# EAGLE design Backplane2 (EAGLE 7.7.0)
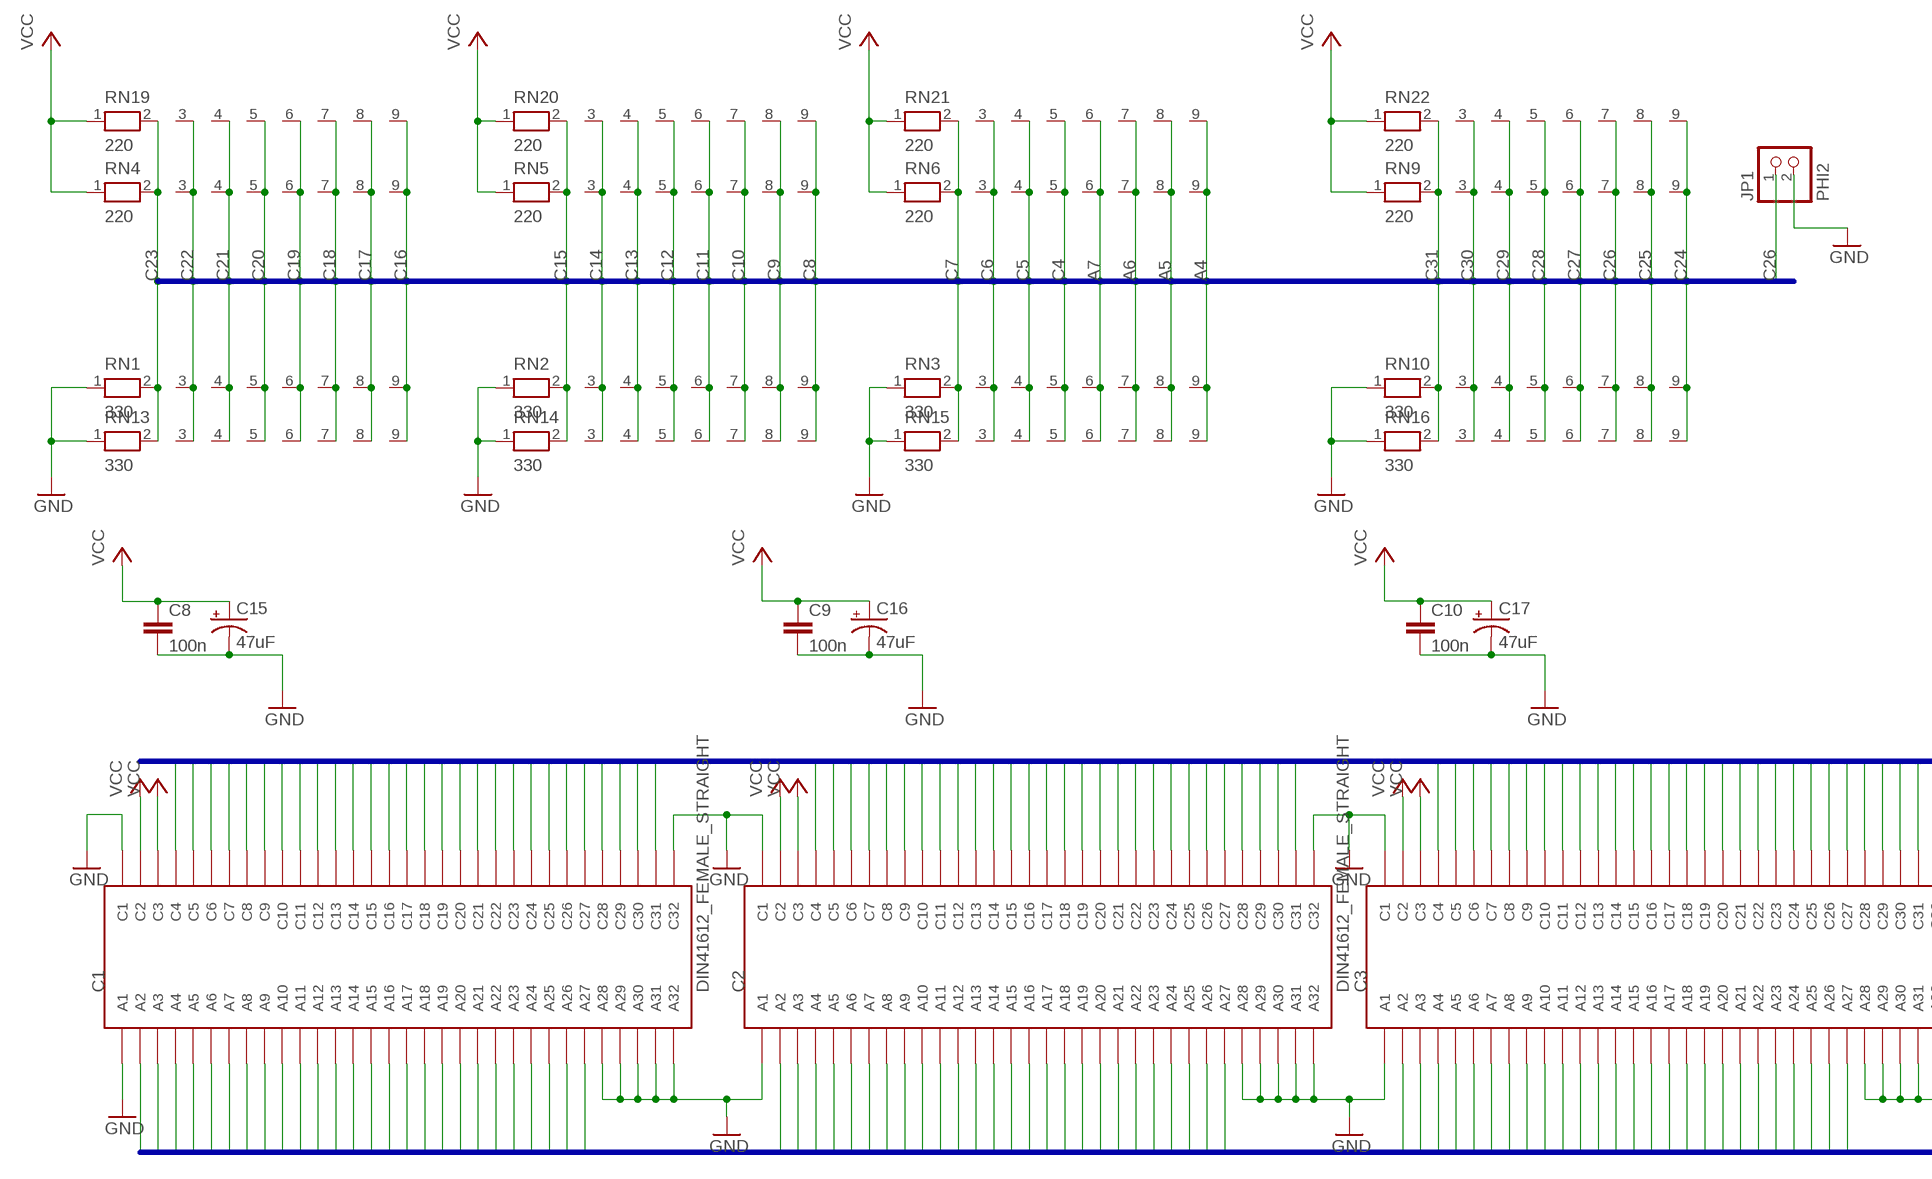
[diagram p0: schematic, sheet 1, part 1 of 2]
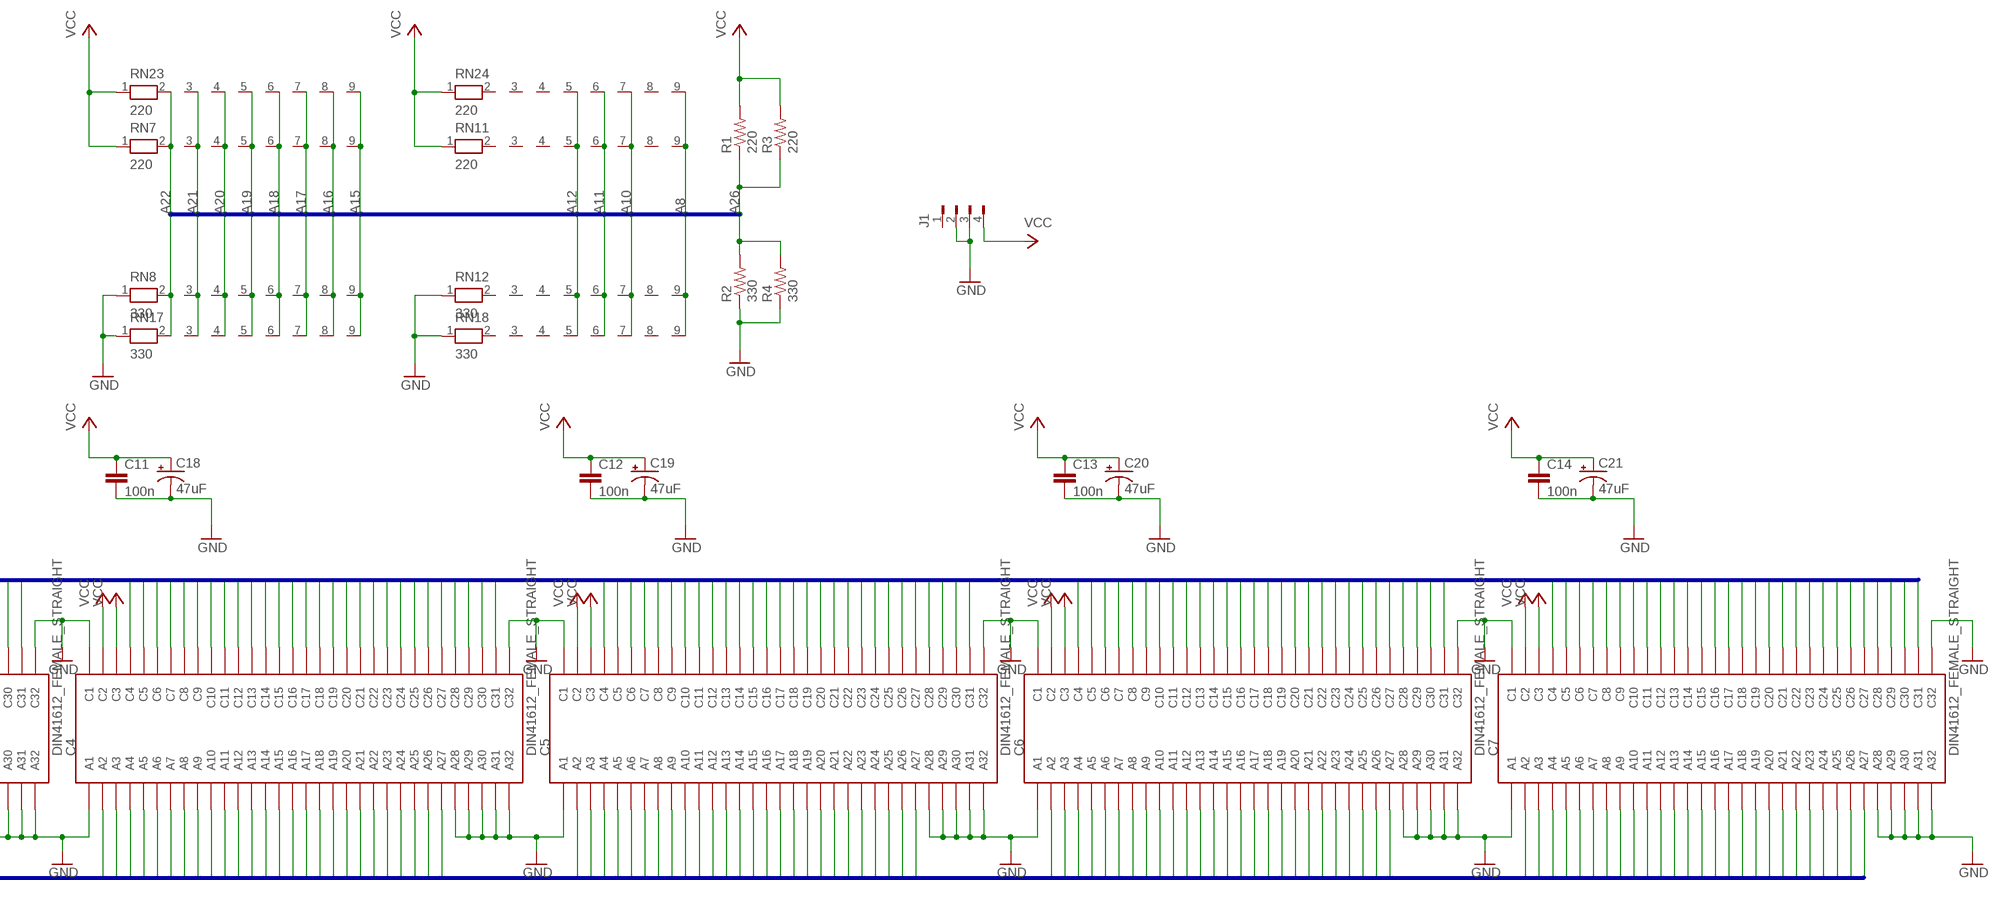
[diagram p1: schematic, sheet 1, part 2 of 2]

## Parts
C1  DIN41612_FEMALE_STRAIGHT  [DIN41612_FEMALE_STRAIGHT]
C2  DIN41612_FEMALE_STRAIGHT  [DIN41612_FEMALE_STRAIGHT]
C3  DIN41612_FEMALE_STRAIGHT  [DIN41612_FEMALE_STRAIGHT]
C4  DIN41612_FEMALE_STRAIGHT  [DIN41612_FEMALE_STRAIGHT]
C5  DIN41612_FEMALE_STRAIGHT  [DIN41612_FEMALE_STRAIGHT]
C6  DIN41612_FEMALE_STRAIGHT  [DIN41612_FEMALE_STRAIGHT]
C7  DIN41612_FEMALE_STRAIGHT  [DIN41612_FEMALE_STRAIGHT]
C8  100n  C-EU025-025X050  [C025-025X050]
C9  100n  C-EU025-025X050  [C025-025X050]
C10  100n  C-EU025-025X050  [C025-025X050]
C11  100n  C-EU025-025X050  [C025-025X050]
C12  100n  C-EU025-025X050  [C025-025X050]
C13  100n  C-EU025-025X050  [C025-025X050]
C14  100n  C-EU025-025X050  [C025-025X050]
C15  47uF  CPOL-USE2.5-7  [E2,5-7]
C16  47uF  CPOL-USE2.5-7  [E2,5-7]
C17  47uF  CPOL-USE2.5-7  [E2,5-7]
C18  47uF  CPOL-USE2.5-7  [E2,5-7]
C19  47uF  CPOL-USE2.5-7  [E2,5-7]
C20  47uF  CPOL-USE2.5-7  [E2,5-7]
C21  47uF  CPOL-USE2.5-7  [E2,5-7]
J1  FLOPPY-4350211  [350211]
JP1  PHI2  PINHD-1X2  [1X02]
R1  220  R-US_0204/5  [0204/5]
R2  330  R-US_0204/5  [0204/5]
R3  220  R-US_0204/5  [0204/5]
R4  330  R-US_0204/5  [0204/5]
RN1  330  RN08  [RN-9]
RN2  330  RN08  [RN-9]
RN3  330  RN08  [RN-9]
RN4  220  RN08  [RN-9]
RN5  220  RN08  [RN-9]
RN6  220  RN08  [RN-9]
RN7  220  RN08  [RN-9]
RN8  330  RN08  [RN-9]
RN9  220  RN08  [RN-9]
RN10  330  RN08  [RN-9]
RN11  220  RN08  [RN-9]
RN12  330  RN08  [RN-9]
RN13  330  RN08  [RN-9]
RN14  330  RN08  [RN-9]
RN15  330  RN08  [RN-9]
RN16  330  RN08  [RN-9]
RN17  330  RN08  [RN-9]
RN18  330  RN08  [RN-9]
RN19  220  RN08  [RN-9]
RN20  220  RN08  [RN-9]
RN21  220  RN08  [RN-9]
RN22  220  RN08  [RN-9]
RN23  220  RN08  [RN-9]
RN24  220  RN08  [RN-9]

## Nets
A2: C1.A2 C2.A2 C3.A2 C4.A2 C5.A2 C6.A2 C7.A2
A3: C1.A3 C2.A3 C3.A3 C4.A3 C5.A3 C6.A3 C7.A3
A4: C1.A4 C2.A4 C3.A4 C4.A4 C5.A4 C6.A4 C7.A4 RN3.9 RN6.9 RN15.9 RN21.9
A5: C1.A5 C2.A5 C3.A5 C4.A5 C5.A5 C6.A5 C7.A5 RN3.8 RN6.8 RN15.8 RN21.8
A6: C1.A6 C2.A6 C3.A6 C4.A6 C5.A6 C6.A6 C7.A6 RN3.7 RN6.7 RN15.7 RN21.7
A7: C1.A7 C2.A7 C3.A7 C4.A7 C5.A7 C6.A7 C7.A7 RN3.6 RN6.6 RN15.6 RN21.6
A8: C1.A8 C2.A8 C3.A8 C4.A8 C5.A8 C6.A8 C7.A8 RN11.9 RN12.9 RN18.9 RN24.9
A9: C1.A9 C2.A9 C3.A9 C4.A9 C5.A9 C6.A9 C7.A9
A10: C1.A10 C2.A10 C3.A10 C4.A10 C5.A10 C6.A10 C7.A10 RN11.7 RN12.7 RN18.7 RN24.7
A11: C1.A11 C2.A11 C3.A11 C4.A11 C5.A11 C6.A11 C7.A11 RN11.6 RN12.6 RN18.6 RN24.6
A12: C1.A12 C2.A12 C3.A12 C4.A12 C5.A12 C6.A12 C7.A12 RN11.5 RN12.5 RN18.5 RN24.5
A13: C1.A13 C2.A13 C3.A13 C4.A13 C5.A13 C6.A13 C7.A13
A14: C1.A14 C2.A14 C3.A14 C4.A14 C5.A14 C6.A14 C7.A14
A15: C1.A15 C2.A15 C3.A15 C4.A15 C5.A15 C6.A15 C7.A15 RN7.9 RN8.9 RN17.9 RN23.9
A16: C1.A16 C2.A16 C3.A16 C4.A16 C5.A16 C6.A16 C7.A16 RN7.8 RN8.8 RN17.8 RN23.8
A17: C1.A17 C2.A17 C3.A17 C4.A17 C5.A17 C6.A17 C7.A17 RN7.7 RN8.7 RN17.7 RN23.7
A18: C1.A18 C2.A18 C3.A18 C4.A18 C5.A18 C6.A18 C7.A18 RN7.6 RN8.6 RN17.6 RN23.6
A19: C1.A19 C2.A19 C3.A19 C4.A19 C5.A19 C6.A19 C7.A19 RN7.5 RN8.5 RN17.5 RN23.5
A20: C1.A20 C2.A20 C3.A20 C4.A20 C5.A20 C6.A20 C7.A20 RN7.4 RN8.4 RN17.4 RN23.4
A21: C1.A21 C2.A21 C3.A21 C4.A21 C5.A21 C6.A21 C7.A21 RN7.3 RN8.3 RN17.3 RN23.3
A22: C1.A22 C2.A22 C3.A22 C4.A22 C5.A22 C6.A22 C7.A22 RN7.2 RN8.2 RN17.2 RN23.2
A23: C1.A23 C2.A23 C3.A23 C4.A23 C5.A23 C6.A23 C7.A23
A24: C1.A24 C2.A24 C3.A24 C4.A24 C5.A24 C6.A24 C7.A24
A25: C1.A25 C2.A25 C3.A25 C4.A25 C5.A25 C6.A25 C7.A25
A26: C1.A26 C2.A26 C3.A26 C4.A26 C5.A26 C6.A26 C7.A26 R1.1 R2.2 R3.1 R4.2
A27: C1.A27 C2.A27 C3.A27 C4.A27 C5.A27 C6.A27 C7.A27
C4: C1.C4 C2.C4 C3.C4 C4.C4 C5.C4 C6.C4 C7.C4 RN3.5 RN6.5 RN15.5 RN21.5
C5: C1.C5 C2.C5 C3.C5 C4.C5 C5.C5 C6.C5 C7.C5 RN3.4 RN6.4 RN15.4 RN21.4
C6: C1.C6 C2.C6 C3.C6 C4.C6 C5.C6 C6.C6 C7.C6 RN3.3 RN6.3 RN15.3 RN21.3
C7: C1.C7 C2.C7 C3.C7 C4.C7 C5.C7 C6.C7 C7.C7 RN3.2 RN6.2 RN15.2 RN21.2
C8: C1.C8 C2.C8 C3.C8 C4.C8 C5.C8 C6.C8 C7.C8 RN2.9 RN5.9 RN14.9 RN20.9
C9: C1.C9 C2.C9 C3.C9 C4.C9 C5.C9 C6.C9 C7.C9 RN2.8 RN5.8 RN14.8 RN20.8
C10: C1.C10 C2.C10 C3.C10 C4.C10 C5.C10 C6.C10 C7.C10 RN2.7 RN5.7 RN14.7 RN20.7
C11: C1.C11 C2.C11 C3.C11 C4.C11 C5.C11 C6.C11 C7.C11 RN2.6 RN5.6 RN14.6 RN20.6
C12: C1.C12 C2.C12 C3.C12 C4.C12 C5.C12 C6.C12 C7.C12 RN2.5 RN5.5 RN14.5 RN20.5
C13: C1.C13 C2.C13 C3.C13 C4.C13 C5.C13 C6.C13 C7.C13 RN2.4 RN5.4 RN14.4 RN20.4
C14: C1.C14 C2.C14 C3.C14 C4.C14 C5.C14 C6.C14 C7.C14 RN2.3 RN5.3 RN14.3 RN20.3
C15: C1.C15 C2.C15 C3.C15 C4.C15 C5.C15 C6.C15 C7.C15 RN2.2 RN5.2 RN14.2 RN20.2
C16: C1.C16 C2.C16 C3.C16 C4.C16 C5.C16 C6.C16 C7.C16 RN1.9 RN4.9 RN13.9 RN19.9
C17: C1.C17 C2.C17 C3.C17 C4.C17 C5.C17 C6.C17 C7.C17 RN1.8 RN4.8 RN13.8 RN19.8
C18: C1.C18 C2.C18 C3.C18 C4.C18 C5.C18 C6.C18 C7.C18 RN1.7 RN4.7 RN13.7 RN19.7
C19: C1.C19 C2.C19 C3.C19 C4.C19 C5.C19 C6.C19 C7.C19 RN1.6 RN4.6 RN13.6 RN19.6
C20: C1.C20 C2.C20 C3.C20 C4.C20 C5.C20 C6.C20 C7.C20 RN1.5 RN4.5 RN13.5 RN19.5
C21: C1.C21 C2.C21 C3.C21 C4.C21 C5.C21 C6.C21 C7.C21 RN1.4 RN4.4 RN13.4 RN19.4
C22: C1.C22 C2.C22 C3.C22 C4.C22 C5.C22 C6.C22 C7.C22 RN1.3 RN4.3 RN13.3 RN19.3
C23: C1.C23 C2.C23 C3.C23 C4.C23 C5.C23 C6.C23 C7.C23 RN1.2 RN4.2 RN13.2 RN19.2
C24: C1.C24 C2.C24 C3.C24 C4.C24 C5.C24 C6.C24 C7.C24 RN9.9 RN10.9 RN16.9 RN22.9
C25: C1.C25 C2.C25 C3.C25 C4.C25 C5.C25 C6.C25 C7.C25 RN9.8 RN10.8 RN16.8 RN22.8
C26: C1.C26 C2.C26 C3.C26 C4.C26 C5.C26 C6.C26 C7.C26 JP1.1 RN9.7 RN10.7 RN16.7 RN22.7
C27: C1.C27 C2.C27 C3.C27 C4.C27 C5.C27 C6.C27 C7.C27 RN9.6 RN10.6 RN16.6 RN22.6
C28: C1.C28 C2.C28 C3.C28 C4.C28 C5.C28 C6.C28 C7.C28 RN9.5 RN10.5 RN16.5 RN22.5
C29: C1.C29 C2.C29 C3.C29 C4.C29 C5.C29 C6.C29 C7.C29 RN9.4 RN10.4 RN16.4 RN22.4
C30: C1.C30 C2.C30 C3.C30 C4.C30 C5.C30 C6.C30 C7.C30 RN9.3 RN10.3 RN16.3 RN22.3
C31: C1.C31 C2.C31 C3.C31 C4.C31 C5.C31 C6.C31 C7.C31 RN9.2 RN10.2 RN16.2 RN22.2
GND: C1.A1 C1.A28 C1.A29 C1.A30 C1.A31 C1.A32 C1.C1 C1.C32 C2.A1 C2.A28 C2.A29 C2.A30 C2.A31 C2.A32 C2.C1 C2.C32 C3.A1 C3.A28 C3.A29 C3.A30 C3.A31 C3.A32 C3.C1 C3.C32 C4.A1 C4.A28 C4.A29 C4.A30 C4.A31 C4.A32 C4.C1 C4.C32 C5.A1 C5.A28 C5.A29 C5.A30 C5.A31 C5.A32 C5.C1 C5.C32 C6.A1 C6.A28 C6.A29 C6.A30 C6.A31 C6.A32 C6.C1 C6.C32 C7.A1 C7.A28 C7.A29 C7.A30 C7.A31 C7.A32 C7.C1 C7.C32 C8.2 C9.2 C10.2 C11.2 C12.2 C13.2 C14.2 C15.- C16.- C17.- C18.- C19.- C20.- C21.- J1.2 J1.3 JP1.2 R2.1 R4.1 RN1.1 RN2.1 RN3.1 RN8.1 RN10.1 RN12.1 RN13.1 RN14.1 RN15.1 RN16.1 RN17.1 RN18.1
VCC: C1.C2 C1.C3 C2.C2 C2.C3 C3.C2 C3.C3 C4.C2 C4.C3 C5.C2 C5.C3 C6.C2 C6.C3 C7.C2 C7.C3 C8.1 C9.1 C10.1 C11.1 C12.1 C13.1 C14.1 C15.+ C16.+ C17.+ C18.+ C19.+ C20.+ C21.+ J1.4 R1.2 R3.2 RN4.1 RN5.1 RN6.1 RN7.1 RN9.1 RN11.1 RN19.1 RN20.1 RN21.1 RN22.1 RN23.1 RN24.1
Unconnected: J1.1 RN11.2 RN11.3 RN11.4 RN11.8 RN12.2 RN12.3 RN12.4 RN12.8 RN18.2 RN18.3 RN18.4 RN18.8 RN24.2 RN24.3 RN24.4 RN24.8

## Buses
A[1..32]
C[1..32]

## Library data of the parts
C1-C7 = DIN41612:DIN41612_FEMALE_STRAIGHT
C8-C14 = rcl:C-EU: CAPACITOR, European symbol
C15-C21 = rcl:CPOL-US: POLARIZED CAPACITOR, American symbol
J1 = con-amp:FLOPPY-4: MATE N-LOCK Floppy / HDD conector Distributor: Bürklin 71F970
JP1 = pinhead:PINHD-1X2: PIN HEADER
R1-R4 = rcl:R-US_: RESISTOR, American symbol
RN1-RN24 = resistor-net:RN08: RESISTOR NETWORK; OC_FARNELL: unknown; OC_NEWARK: unknown

## Board
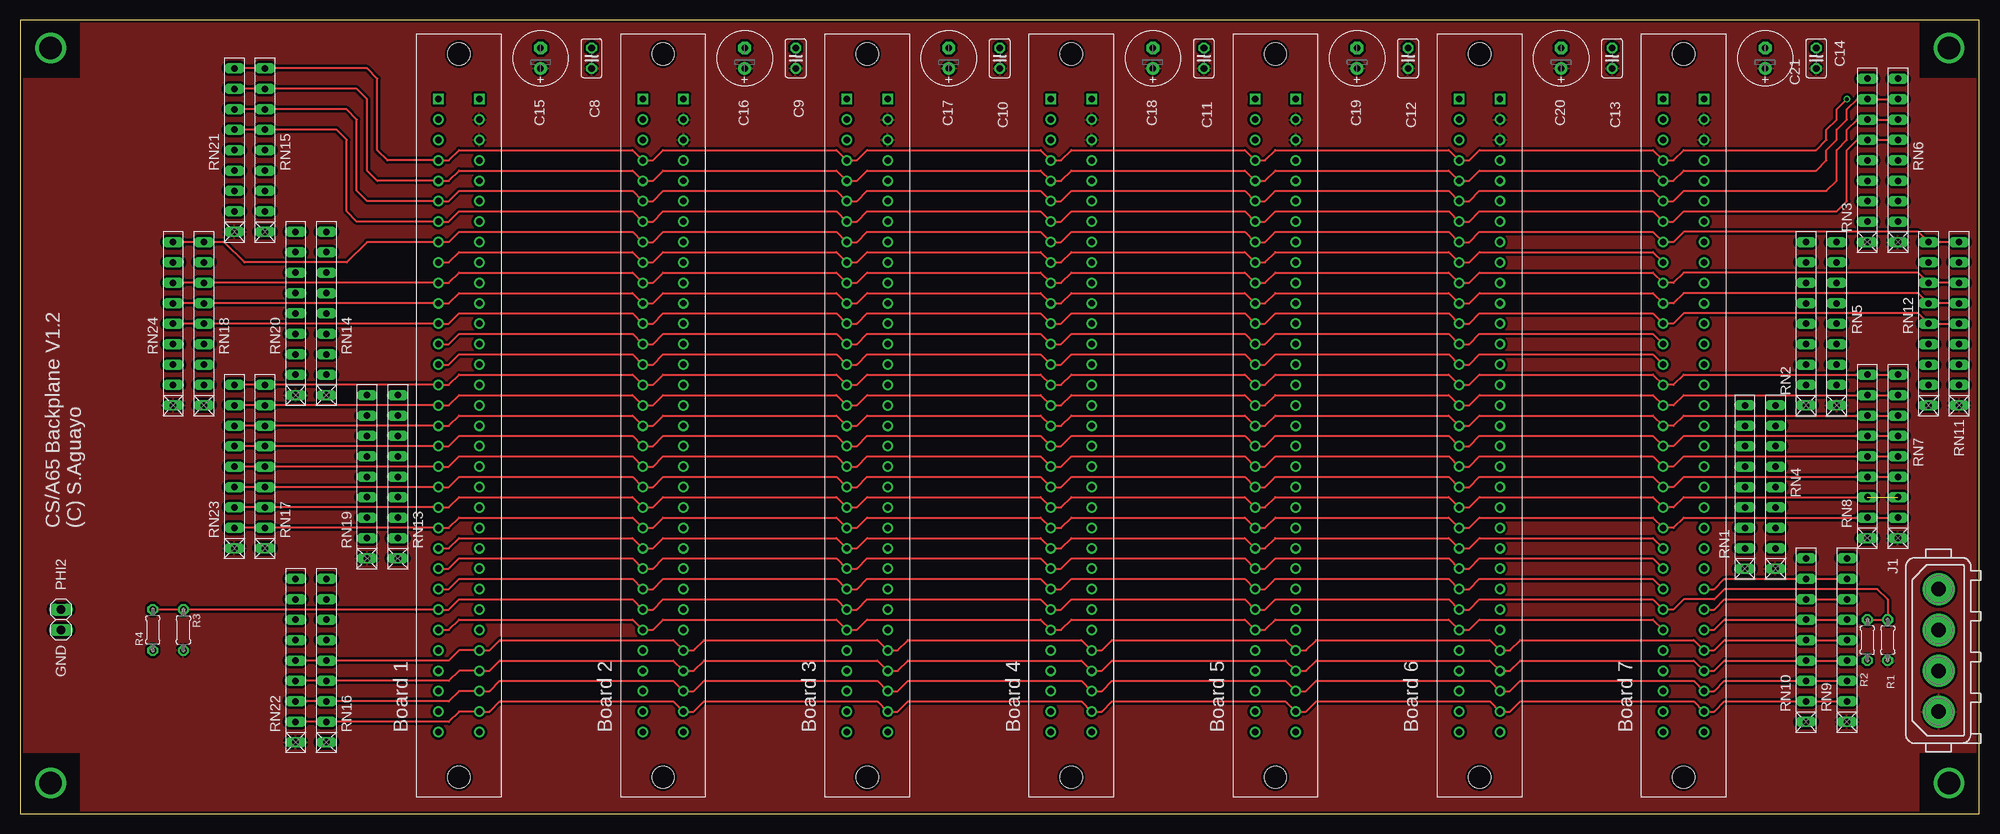
[diagram p2: board, top side]
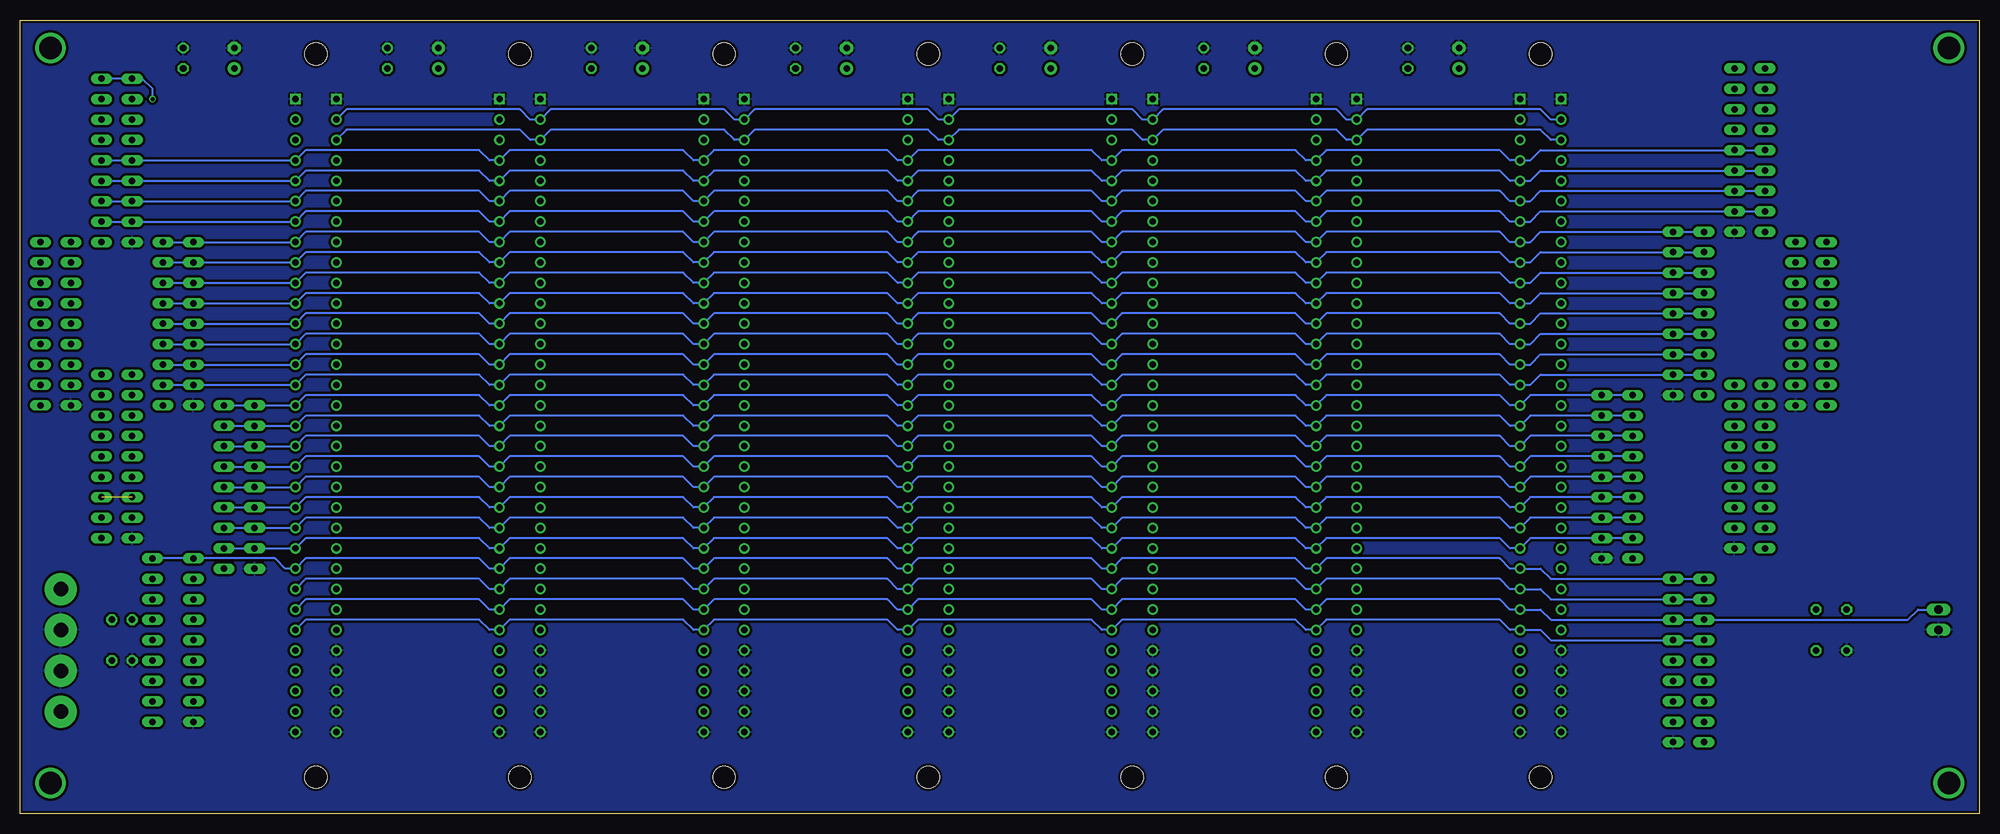
[diagram p3: board, bottom side, seen from below]

Size 243.82 x 98.73 mm. Coordinates in mm from the lower left corner, seen from the top.
Outline: 0,0 243.82,0 243.82,98.73 0,98.73 0,0
Copper layers (1*16): Top 0.035mm / dielectric 1.5mm / Bottom 0.035mm
Design rules "SeeedStudio_2layer_DRU_no_angle_20140221": minimum track width 6mil, minimum drill 12mil, track to track 6mil, track to pad 6mil, pad to pad 6mil, via to via 6mil, smd to smd 0mil, copper to edge 10mil, drill to drill 10mil, minimum pad ring 10mil, minimum via ring 6mil, stop-mask expansion 2mil, vias tented up to drill 100mil, thermal gap 10mil

### Footprints (pad centres in the part's own frame; a part is rotated, then mirrored left to right if it is on the bottom)
DIN41612_FEMALE_STRAIGHT = drill 0.8 square: A1 39.37,2.54; C1 39.37,-2.54 | drill 0.8: A2 36.83,2.54; A3 34.29,2.54; A4 31.75,2.54; A5 29.21,2.54; A6 26.67,2.54; A7 24.13,2.54; A8 21.59,2.54; A9 19.05,2.54; A10 16.51,2.54; A11 13.97,2.54; A12 11.43,2.54; A13 8.89,2.54; A14 6.35,2.54; A15 3.81,2.54; A16 1.27,2.54; A17 -1.27,2.54; A18 -3.81,2.54; A19 -6.35,2.54; A20 -8.89,2.54; A21 -11.43,2.54; A22 -13.97,2.54; A23 -16.51,2.54; A24 -19.05,2.54; A25 -21.59,2.54; A26 -24.13,2.54; A27 -26.67,2.54; A28 -29.21,2.54; A29 -31.75,2.54; A30 -34.29,2.54; A31 -36.83,2.54; A32 -39.37,2.54; C2 36.83,-2.54; C3 34.29,-2.54; C4 31.75,-2.54; C5 29.21,-2.54; C6 26.67,-2.54; C7 24.13,-2.54; C8 21.59,-2.54; C9 19.05,-2.54; C10 16.51,-2.54; C11 13.97,-2.54; C12 11.43,-2.54; C13 8.89,-2.54; C14 6.35,-2.54; C15 3.81,-2.54; C16 1.27,-2.54; C17 -1.27,-2.54; C18 -3.81,-2.54; C19 -6.35,-2.54; C20 -8.89,-2.54; C21 -11.43,-2.54; C22 -13.97,-2.54; C23 -16.51,-2.54; C24 -19.05,-2.54; C25 -21.59,-2.54; C26 -24.13,-2.54; C27 -26.67,-2.54; C28 -29.21,-2.54; C29 -31.75,-2.54; C30 -34.29,-2.54; C31 -36.83,-2.54; C32 -39.37,-2.54 | hole 2.8: -45,0; 45,0
C025-025X050 = drill 0.813 octagon: 1 -1.27,0; 2 1.27,0
E2,5-7 = drill 0.813 pad 1.6: + -1.27,0 | drill 0.813 pad 1.6 octagon: - 1.27,0
350211 = drill 1.8 pad 4: 1 -7.62,0; 2 -2.54,0; 3 2.54,0; 4 7.62,0
1X02 = drill 1.016 long: 1 -1.27,0; 2 1.27,0
0204/5 = drill 0.813 octagon: 1 -2.54,0; 2 2.54,0
RN-9 = drill 0.813 long: 1 -10.16,0; 2 -7.62,0; 3 -5.08,0; 4 -2.54,0; 5 0,0; 6 2.54,0; 7 5.08,0; 8 7.62,0; 9 10.16,0

### Placement (x,y rotation side)
C1  54.61,49.53 90 top
C2  80.01,49.53 90 top
C3  105.41,49.53 90 top
C4  130.81,49.53 90 top
C5  156.21,49.53 90 top
C6  181.61,49.53 90 top
C7  207.01,49.53 90 top
C8  71.12,93.98 90 top
C9  96.52,93.98 90 top
C10  121.92,93.98 90 top
C11  147.32,93.98 90 top
C12  172.72,93.98 90 top
C13  198.12,93.98 90 top
C14  223.52,93.98 90 top
C15  64.77,93.98 90 top
C16  90.17,93.98 90 top
C17  115.57,93.98 90 top
C18  140.97,93.98 90 top
C19  166.37,93.98 90 top
C20  191.77,93.98 90 top
C21  217.17,93.98 90 top
J1  238.76,20.32 270 top
JP1  5.08,24.13 270 top
R1  232.41,21.59 270 top
R2  229.87,21.59 90 top
R3  20.32,22.86 270 top
R4  16.51,22.86 90 top
RN1  214.63,40.64 90 top
RN2  222.25,60.96 90 top
RN3  229.87,81.28 90 top
RN4  218.44,40.64 90 top
RN5  226.06,60.96 90 top
RN6  233.68,81.28 90 top
RN7  233.68,44.45 90 top
RN8  229.87,44.45 90 top
RN9  227.33,21.59 90 top
RN10  222.25,21.59 90 top
RN11  241.3,60.96 90 top
RN12  237.49,60.96 90 top
RN13  46.99,41.91 90 top
RN14  38.1,62.23 90 top
RN15  30.48,82.55 90 top
RN16  38.1,19.05 90 top
RN17  30.48,43.18 90 top
RN18  22.86,60.96 90 top
RN19  43.18,41.91 90 top
RN20  34.29,62.23 90 top
RN21  26.67,82.55 90 top
RN22  34.29,19.05 90 top
RN23  26.67,43.18 90 top
RN24  19.05,60.96 90 top

### Tracks (layer width: path | path; a pad name or v marks a point on that pad's centre or on a via)
A2
  Bottom 0.254: C1.A2 53.34,86.36 54.61,87.63 76.2,87.63 C2.A2 78.74,86.36 80.01,87.63 101.6,87.63 C3.A2 104.14,86.36 105.41,87.63 127,87.63 C4.A2 129.54,86.36 130.81,87.63 152.4,87.63 C5.A2 154.94,86.36 156.21,87.63 177.8,87.63 C6.A2 180.34,86.36 181.61,87.63 203.2,87.63 C7.A2
A3
  Bottom 0.254: C1.A3 53.34,83.82 54.61,85.09 76.2,85.09 C2.A3 78.74,83.82 80.01,85.09 101.6,85.09 C3.A3 104.14,83.82 105.41,85.09 127,85.09 C4.A3 129.54,83.82 130.81,85.09 152.4,85.09 C5.A3 154.94,83.82 156.21,85.09 177.8,85.09 C6.A3 180.34,83.82 181.61,85.09 203.2,85.09 C7.A3
A4  (via drill 0.5)
  Top 0.254: v227.33,88.9 226.06,87.63 226.06,86.36 224.79,85.09 224.79,83.82 223.52,82.55 207.01,82.55 205.74,81.28 C7.A4 203.2,82.55 181.61,82.55 180.34,81.28 C6.A4 177.8,82.55 156.21,82.55 154.94,81.28 C5.A4 152.4,82.55 130.81,82.55 129.54,81.28 C4.A4 127,82.55 105.41,82.55 104.14,81.28 C3.A4 101.6,82.55 80.01,82.55 78.74,81.28 C2.A4 76.2,82.55 54.61,82.55 53.34,81.28 C1.A4 45.72,81.28 44.45,82.55 44.45,91.44 43.18,92.71 RN15.9 RN21.9
  Bottom 0.254: v227.33,88.9 227.33,90.17 228.6,91.44 RN3.9 RN6.9
A5
  Top 0.254: RN6.8 RN3.8 228.6,88.9 227.33,87.63 227.33,86.36 226.06,85.09 226.06,83.82 224.79,82.55 224.79,81.28 223.52,80.01 207.01,80.01 205.74,78.74 C7.A5 203.2,80.01 181.61,80.01 180.34,78.74 C6.A5 177.8,80.01 156.21,80.01 154.94,78.74 C5.A5 152.4,80.01 130.81,80.01 129.54,78.74 C4.A5 127,80.01 105.41,80.01 104.14,78.74 C3.A5 101.6,80.01 80.01,80.01 78.74,78.74 C2.A5 76.2,80.01 54.61,80.01 53.34,78.74 C1.A5 44.45,78.74 43.18,80.01 43.18,88.9 41.91,90.17 RN15.8 RN21.8
A6
  Top 0.254: RN6.7 RN3.7 228.6,86.36 227.33,85.09 227.33,83.82 226.06,82.55 226.06,78.74 224.79,77.47 207.01,77.47 205.74,76.2 C7.A6 203.2,77.47 181.61,77.47 180.34,76.2 C6.A6 177.8,77.47 156.21,77.47 154.94,76.2 C5.A6 152.4,77.47 130.81,77.47 129.54,76.2 C4.A6 127,77.47 105.41,77.47 104.14,76.2 C3.A6 101.6,77.47 80.01,77.47 78.74,76.2 C2.A6 76.2,77.47 54.61,77.47 53.34,76.2 C1.A6 43.18,76.2 41.91,77.47 41.91,86.36 40.64,87.63 RN15.7 RN21.7
A7
  Top 0.254: RN6.6 RN3.6 228.6,83.82 227.33,82.55 227.33,76.2 226.06,74.93 207.01,74.93 205.74,73.66 C7.A7 203.2,74.93 181.61,74.93 180.34,73.66 C6.A7 177.8,74.93 156.21,74.93 154.94,73.66 C5.A7 152.4,74.93 130.81,74.93 129.54,73.66 C4.A7 127,74.93 105.41,74.93 104.14,73.66 C3.A7 101.6,74.93 80.01,74.93 78.74,73.66 C2.A7 76.2,74.93 54.61,74.93 53.34,73.66 C1.A7 41.91,73.66 40.64,74.93 40.64,83.82 39.37,85.09 RN15.6 RN21.6
A8
  Top 0.254: RN11.9 RN12.9 236.22,72.39 207.01,72.39 205.74,71.12 C7.A8 203.2,72.39 181.61,72.39 180.34,71.12 C6.A8 177.8,72.39 156.21,72.39 154.94,71.12 C5.A8 152.4,72.39 130.81,72.39 129.54,71.12 C4.A8 127,72.39 105.41,72.39 104.14,71.12 C3.A8 101.6,72.39 80.01,72.39 78.74,71.12 C2.A8 76.2,72.39 54.61,72.39 53.34,71.12 C1.A8 43.18,71.12 40.64,68.58 27.94,68.58 25.4,71.12 RN18.9 RN24.9
A9
  Top 0.254: C1.A9 53.34,68.58 54.61,69.85 76.2,69.85 C2.A9 78.74,68.58 80.01,69.85 101.6,69.85 C3.A9 104.14,68.58 105.41,69.85 127,69.85 C4.A9 129.54,68.58 130.81,69.85 152.4,69.85 C5.A9 154.94,68.58 156.21,69.85 177.8,69.85 C6.A9 180.34,68.58 181.61,69.85 203.2,69.85 C7.A9
A10
  Top 0.254: RN11.7 RN12.7 236.22,67.31 207.01,67.31 205.74,66.04 C7.A10 203.2,67.31 181.61,67.31 180.34,66.04 C6.A10 177.8,67.31 156.21,67.31 154.94,66.04 C5.A10 152.4,67.31 130.81,67.31 129.54,66.04 C4.A10 127,67.31 105.41,67.31 104.14,66.04 C3.A10 101.6,67.31 80.01,67.31 78.74,66.04 C2.A10 76.2,67.31 54.61,67.31 53.34,66.04 C1.A10 RN18.7 RN24.7
A11
  Top 0.254: RN11.6 RN12.6 236.22,64.77 207.01,64.77 205.74,63.5 C7.A11 203.2,64.77 181.61,64.77 180.34,63.5 C6.A11 177.8,64.77 156.21,64.77 154.94,63.5 C5.A11 152.4,64.77 130.81,64.77 129.54,63.5 C4.A11 127,64.77 105.41,64.77 104.14,63.5 C3.A11 101.6,64.77 80.01,64.77 78.74,63.5 C2.A11 76.2,64.77 54.61,64.77 53.34,63.5 C1.A11 RN18.6 RN24.6
A12
  Top 0.254: RN11.5 RN12.5 236.22,62.23 207.01,62.23 205.74,60.96 C7.A12 203.2,62.23 181.61,62.23 180.34,60.96 C6.A12 177.8,62.23 156.21,62.23 154.94,60.96 C5.A12 152.4,62.23 130.81,62.23 129.54,60.96 C4.A12 127,62.23 105.41,62.23 104.14,60.96 C3.A12 101.6,62.23 80.01,62.23 78.74,60.96 C2.A12 76.2,62.23 54.61,62.23 53.34,60.96 C1.A12 RN18.5 RN24.5
A13
  Top 0.254: C1.A13 53.34,58.42 54.61,59.69 76.2,59.69 C2.A13 78.74,58.42 80.01,59.69 101.6,59.69 C3.A13 104.14,58.42 105.41,59.69 127,59.69 C4.A13 129.54,58.42 130.81,59.69 152.4,59.69 C5.A13 154.94,58.42 156.21,59.69 177.8,59.69 C6.A13 180.34,58.42 181.61,59.69 203.2,59.69 C7.A13
A14
  Top 0.254: C1.A14 53.34,55.88 54.61,57.15 76.2,57.15 C2.A14 78.74,55.88 80.01,57.15 101.6,57.15 C3.A14 104.14,55.88 105.41,57.15 127,57.15 C4.A14 129.54,55.88 130.81,57.15 152.4,57.15 C5.A14 154.94,55.88 156.21,57.15 177.8,57.15 C6.A14 180.34,55.88 181.61,57.15 203.2,57.15 C7.A14
A15
  Top 0.254: RN7.9 RN8.9 207.01,54.61 205.74,53.34 C7.A15 203.2,54.61 181.61,54.61 180.34,53.34 C6.A15 177.8,54.61 156.21,54.61 154.94,53.34 C5.A15 152.4,54.61 130.81,54.61 129.54,53.34 C4.A15 127,54.61 105.41,54.61 104.14,53.34 C3.A15 101.6,54.61 80.01,54.61 78.74,53.34 C2.A15 76.2,54.61 54.61,54.61 53.34,53.34 C1.A15 RN17.9 RN23.9
A16
  Top 0.254: RN7.8 RN8.8 207.01,52.07 205.74,50.8 C7.A16 203.2,52.07 181.61,52.07 180.34,50.8 C6.A16 177.8,52.07 156.21,52.07 154.94,50.8 C5.A16 152.4,52.07 130.81,52.07 129.54,50.8 C4.A16 127,52.07 105.41,52.07 104.14,50.8 C3.A16 101.6,52.07 80.01,52.07 78.74,50.8 C2.A16 76.2,52.07 54.61,52.07 53.34,50.8 C1.A16 RN17.8 RN23.8
A17
  Top 0.254: RN7.7 RN8.7 207.01,49.53 205.74,48.26 C7.A17 203.2,49.53 181.61,49.53 180.34,48.26 C6.A17 177.8,49.53 156.21,49.53 154.94,48.26 C5.A17 152.4,49.53 130.81,49.53 129.54,48.26 C4.A17 127,49.53 105.41,49.53 104.14,48.26 C3.A17 101.6,49.53 80.01,49.53 78.74,48.26 C2.A17 76.2,49.53 54.61,49.53 53.34,48.26 C1.A17 RN17.7 RN23.7
A18
  Top 0.254: RN7.6 RN8.6 207.01,46.99 205.74,45.72 C7.A18 203.2,46.99 181.61,46.99 180.34,45.72 C6.A18 177.8,46.99 156.21,46.99 154.94,45.72 C5.A18 152.4,46.99 130.81,46.99 129.54,45.72 C4.A18 127,46.99 105.41,46.99 104.14,45.72 C3.A18 101.6,46.99 80.01,46.99 78.74,45.72 C2.A18 76.2,46.99 54.61,46.99 53.34,45.72 C1.A18 RN17.6 RN23.6
A19
  Top 0.254: RN7.5 RN8.5 207.01,44.45 205.74,43.18 C7.A19 203.2,44.45 181.61,44.45 180.34,43.18 C6.A19 177.8,44.45 156.21,44.45 154.94,43.18 C5.A19 152.4,44.45 130.81,44.45 129.54,43.18 C4.A19 127,44.45 105.41,44.45 104.14,43.18 C3.A19 101.6,44.45 80.01,44.45 78.74,43.18 C2.A19 76.2,44.45 54.61,44.45 53.34,43.18 C1.A19 RN17.5 RN23.5
A20
  Top 0.254: RN7.4 RN8.4 207.01,41.91 205.74,40.64 C7.A20 203.2,41.91 181.61,41.91 180.34,40.64 C6.A20 177.8,41.91 156.21,41.91 154.94,40.64 C5.A20 152.4,41.91 130.81,41.91 129.54,40.64 C4.A20 127,41.91 105.41,41.91 104.14,40.64 C3.A20 101.6,41.91 80.01,41.91 78.74,40.64 C2.A20 76.2,41.91 54.61,41.91 53.34,40.64 C1.A20 RN17.4 RN23.4
A21  (1 unrouted)
  Top 0.254: RN8.3 207.01,39.37 205.74,38.1 C7.A21 203.2,39.37 181.61,39.37 180.34,38.1 C6.A21 177.8,39.37 156.21,39.37 154.94,38.1 C5.A21 152.4,39.37 130.81,39.37 129.54,38.1 C4.A21 127,39.37 105.41,39.37 104.14,38.1 C3.A21 101.6,39.37 80.01,39.37 78.74,38.1 C2.A21 76.2,39.37 54.61,39.37 53.34,38.1 C1.A21 RN17.3 RN23.3
A22
  Top 0.254: RN7.2 RN8.2 207.01,36.83 205.74,35.56 C7.A22 203.2,36.83 181.61,36.83 180.34,35.56 C6.A22 177.8,36.83 156.21,36.83 154.94,35.56 C5.A22 152.4,36.83 130.81,36.83 129.54,35.56 C4.A22 127,36.83 105.41,36.83 104.14,35.56 C3.A22 101.6,36.83 80.01,36.83 78.74,35.56 C2.A22 76.2,36.83 54.61,36.83 53.34,35.56 C1.A22 RN17.2 RN23.2
A23
  Top 0.254: C1.A23 53.34,33.02 54.61,34.29 76.2,34.29 C2.A23 78.74,33.02 80.01,34.29 101.6,34.29 C3.A23 104.14,33.02 105.41,34.29 127,34.29 C4.A23 129.54,33.02 130.81,34.29 152.4,34.29 C5.A23 154.94,33.02 156.21,34.29 177.8,34.29 C6.A23 180.34,33.02 181.61,34.29 203.2,34.29 C7.A23
A24
  Top 0.254: C1.A24 53.34,30.48 54.61,31.75 76.2,31.75 C2.A24 78.74,30.48 80.01,31.75 101.6,31.75 C3.A24 104.14,30.48 105.41,31.75 127,31.75 C4.A24 129.54,30.48 130.81,31.75 152.4,31.75 C5.A24 154.94,30.48 156.21,31.75 177.8,31.75 C6.A24 180.34,30.48 181.61,31.75 203.2,31.75 C7.A24
A25
  Top 0.254: C1.A25 53.34,27.94 54.61,29.21 76.2,29.21 C2.A25 78.74,27.94 80.01,29.21 101.6,29.21 C3.A25 104.14,27.94 105.41,29.21 127,29.21 C4.A25 129.54,27.94 130.81,29.21 152.4,29.21 C5.A25 154.94,27.94 156.21,29.21 177.8,29.21 C6.A25 180.34,27.94 181.61,29.21 203.2,29.21 C7.A25
A26
  Top 0.254: R2.2 R1.1 232.41,26.67 231.14,27.94 212.09,27.94 210.82,26.67 207.01,26.67 205.74,25.4 C7.A26 203.2,26.67 181.61,26.67 180.34,25.4 C6.A26 177.8,26.67 156.21,26.67 154.94,25.4 C5.A26 152.4,26.67 130.81,26.67 129.54,25.4 C4.A26 127,26.67 105.41,26.67 104.14,25.4 C3.A26 101.6,26.67 80.01,26.67 78.74,25.4 C2.A26 76.2,26.67 54.61,26.67 53.34,25.4 C1.A26 R3.1 R4.2
A27
  Top 0.254: C1.A27 53.34,22.86 54.61,24.13 76.2,24.13 C2.A27 78.74,22.86 80.01,24.13 101.6,24.13 C3.A27 104.14,22.86 105.41,24.13 127,24.13 C4.A27 129.54,22.86 130.81,24.13 152.4,24.13 C5.A27 154.94,22.86 156.21,24.13 177.8,24.13 C6.A27 180.34,22.86 181.61,24.13 203.2,24.13 C7.A27
C4
  Bottom 0.254: RN6.5 RN3.5 C7.C4 208.28,82.55 186.69,82.55 185.42,81.28 C6.C4 182.88,82.55 161.29,82.55 160.02,81.28 C5.C4 157.48,82.55 135.89,82.55 134.62,81.28 C4.C4 132.08,82.55 110.49,82.55 109.22,81.28 C3.C4 106.68,82.55 85.09,82.55 83.82,81.28 C2.C4 81.28,82.55 59.69,82.55 58.42,81.28 C1.C4 55.88,81.28 54.61,82.55 RN15.5 RN21.5
C5
  Bottom 0.254: RN6.4 RN3.4 C7.C5 208.28,80.01 186.69,80.01 185.42,78.74 C6.C5 182.88,80.01 161.29,80.01 160.02,78.74 C5.C5 157.48,80.01 135.89,80.01 134.62,78.74 C4.C5 132.08,80.01 110.49,80.01 109.22,78.74 C3.C5 106.68,80.01 85.09,80.01 83.82,78.74 C2.C5 81.28,80.01 59.69,80.01 58.42,78.74 C1.C5 55.88,78.74 54.61,80.01 RN15.4 RN21.4
C6
  Bottom 0.254: RN6.3 RN3.3 C7.C6 208.28,77.47 186.69,77.47 185.42,76.2 C6.C6 182.88,77.47 161.29,77.47 160.02,76.2 C5.C6 157.48,77.47 135.89,77.47 134.62,76.2 C4.C6 132.08,77.47 110.49,77.47 109.22,76.2 C3.C6 106.68,77.47 85.09,77.47 83.82,76.2 C2.C6 81.28,77.47 59.69,77.47 58.42,76.2 C1.C6 55.88,76.2 54.61,77.47 RN15.3 RN21.3
C7
  Bottom 0.254: RN6.2 RN3.2 C7.C7 208.28,74.93 186.69,74.93 185.42,73.66 C6.C7 182.88,74.93 161.29,74.93 160.02,73.66 C5.C7 157.48,74.93 135.89,74.93 134.62,73.66 C4.C7 132.08,74.93 110.49,74.93 109.22,73.66 C3.C7 106.68,74.93 85.09,74.93 83.82,73.66 C2.C7 81.28,74.93 59.69,74.93 58.42,73.66 C1.C7 55.88,73.66 54.61,74.93 RN15.2 RN21.2
C8
  Bottom 0.254: RN5.9 RN2.9 C7.C8 208.28,72.39 186.69,72.39 185.42,71.12 C6.C8 182.88,72.39 161.29,72.39 160.02,71.12 C5.C8 157.48,72.39 135.89,72.39 134.62,71.12 C4.C8 132.08,72.39 110.49,72.39 109.22,71.12 C3.C8 106.68,72.39 85.09,72.39 83.82,71.12 C2.C8 81.28,72.39 59.69,72.39 58.42,71.12 C1.C8 55.88,71.12 54.61,72.39 RN14.9 RN20.9
C9
  Bottom 0.254: RN5.8 RN2.8 C7.C9 208.28,69.85 186.69,69.85 185.42,68.58 C6.C9 182.88,69.85 161.29,69.85 160.02,68.58 C5.C9 157.48,69.85 135.89,69.85 134.62,68.58 C4.C9 132.08,69.85 110.49,69.85 109.22,68.58 C3.C9 106.68,69.85 85.09,69.85 83.82,68.58 C2.C9 81.28,69.85 59.69,69.85 58.42,68.58 C1.C9 55.88,68.58 54.61,69.85 RN14.8 RN20.8
C10
  Bottom 0.254: RN5.7 RN2.7 C7.C10 208.28,67.31 186.69,67.31 185.42,66.04 C6.C10 182.88,67.31 161.29,67.31 160.02,66.04 C5.C10 157.48,67.31 135.89,67.31 134.62,66.04 C4.C10 132.08,67.31 110.49,67.31 109.22,66.04 C3.C10 106.68,67.31 85.09,67.31 83.82,66.04 C2.C10 81.28,67.31 59.69,67.31 58.42,66.04 C1.C10 55.88,66.04 54.61,67.31 RN14.7 RN20.7
C11
  Bottom 0.254: RN5.6 RN2.6 C7.C11 208.28,64.77 186.69,64.77 185.42,63.5 C6.C11 182.88,64.77 161.29,64.77 160.02,63.5 C5.C11 157.48,64.77 135.89,64.77 134.62,63.5 C4.C11 132.08,64.77 110.49,64.77 109.22,63.5 C3.C11 106.68,64.77 85.09,64.77 83.82,63.5 C2.C11 81.28,64.77 59.69,64.77 58.42,63.5 C1.C11 55.88,63.5 54.61,64.77 RN14.6 RN20.6
C12
  Bottom 0.254: RN5.5 RN2.5 C7.C12 208.28,62.23 186.69,62.23 185.42,60.96 C6.C12 182.88,62.23 161.29,62.23 160.02,60.96 C5.C12 157.48,62.23 135.89,62.23 134.62,60.96 C4.C12 132.08,62.23 110.49,62.23 109.22,60.96 C3.C12 106.68,62.23 85.09,62.23 83.82,60.96 C2.C12 81.28,62.23 59.69,62.23 58.42,60.96 C1.C12 55.88,60.96 54.61,62.23 RN14.5 RN20.5
C13
  Bottom 0.254: RN5.4 RN2.4 C7.C13 208.28,59.69 186.69,59.69 185.42,58.42 C6.C13 182.88,59.69 161.29,59.69 160.02,58.42 C5.C13 157.48,59.69 135.89,59.69 134.62,58.42 C4.C13 132.08,59.69 110.49,59.69 109.22,58.42 C3.C13 106.68,59.69 85.09,59.69 83.82,58.42 C2.C13 81.28,59.69 59.69,59.69 58.42,58.42 C1.C13 55.88,58.42 54.61,59.69 RN14.4 RN20.4
C14
  Bottom 0.254: RN5.3 RN2.3 C7.C14 208.28,57.15 186.69,57.15 185.42,55.88 C6.C14 182.88,57.15 161.29,57.15 160.02,55.88 C5.C14 157.48,57.15 135.89,57.15 134.62,55.88 C4.C14 132.08,57.15 110.49,57.15 109.22,55.88 C3.C14 106.68,57.15 85.09,57.15 83.82,55.88 C2.C14 81.28,57.15 59.69,57.15 58.42,55.88 C1.C14 55.88,55.88 54.61,57.15 RN14.3 RN20.3
C15
  Bottom 0.254: RN5.2 RN2.2 C7.C15 208.28,54.61 186.69,54.61 185.42,53.34 C6.C15 182.88,54.61 161.29,54.61 160.02,53.34 C5.C15 157.48,54.61 135.89,54.61 134.62,53.34 C4.C15 132.08,54.61 110.49,54.61 109.22,53.34 C3.C15 106.68,54.61 85.09,54.61 83.82,53.34 C2.C15 81.28,54.61 59.69,54.61 58.42,53.34 C1.C15 55.88,53.34 54.61,54.61 RN14.2 RN20.2
C16
  Bottom 0.254: RN4.9 RN1.9 C7.C16 208.28,52.07 186.69,52.07 185.42,50.8 C6.C16 182.88,52.07 161.29,52.07 160.02,50.8 C5.C16 157.48,52.07 135.89,52.07 134.62,50.8 C4.C16 132.08,52.07 110.49,52.07 109.22,50.8 C3.C16 106.68,52.07 85.09,52.07 83.82,50.8 C2.C16 81.28,52.07 59.69,52.07 58.42,50.8 C1.C16 55.88,52.07 RN13.9 RN19.9
C17
  Bottom 0.254: RN4.8 RN1.8 C7.C17 208.28,49.53 186.69,49.53 185.42,48.26 C6.C17 182.88,49.53 161.29,49.53 160.02,48.26 C5.C17 157.48,49.53 135.89,49.53 134.62,48.26 C4.C17 132.08,49.53 110.49,49.53 109.22,48.26 C3.C17 106.68,49.53 85.09,49.53 83.82,48.26 C2.C17 81.28,49.53 59.69,49.53 58.42,48.26 C1.C17 55.88,49.53 RN13.8 RN19.8
C18
  Bottom 0.254: RN4.7 RN1.7 C7.C18 208.28,46.99 186.69,46.99 185.42,45.72 C6.C18 182.88,46.99 161.29,46.99 160.02,45.72 C5.C18 157.48,46.99 135.89,46.99 134.62,45.72 C4.C18 132.08,46.99 110.49,46.99 109.22,45.72 C3.C18 106.68,46.99 85.09,46.99 83.82,45.72 C2.C18 81.28,46.99 59.69,46.99 58.42,45.72 C1.C18 55.88,46.99 RN13.7 RN19.7
C19
  Bottom 0.254: RN4.6 RN1.6 C7.C19 208.28,44.45 186.69,44.45 185.42,43.18 C6.C19 182.88,44.45 161.29,44.45 160.02,43.18 C5.C19 157.48,44.45 135.89,44.45 134.62,43.18 C4.C19 132.08,44.45 110.49,44.45 109.22,43.18 C3.C19 106.68,44.45 85.09,44.45 83.82,43.18 C2.C19 81.28,44.45 59.69,44.45 58.42,43.18 C1.C19 55.88,44.45 RN13.6 RN19.6
C20
  Bottom 0.254: RN4.5 RN1.5 C7.C20 208.28,41.91 186.69,41.91 185.42,40.64 C6.C20 182.88,41.91 161.29,41.91 160.02,40.64 C5.C20 157.48,41.91 135.89,41.91 134.62,40.64 C4.C20 132.08,41.91 110.49,41.91 109.22,40.64 C3.C20 106.68,41.91 85.09,41.91 83.82,40.64 C2.C20 81.28,41.91 59.69,41.91 58.42,40.64 C1.C20 55.88,41.91 RN13.5 RN19.5
C21
  Bottom 0.254: RN4.4 RN1.4 C7.C21 208.28,39.37 186.69,39.37 185.42,38.1 C6.C21 182.88,39.37 161.29,39.37 160.02,38.1 C5.C21 157.48,39.37 135.89,39.37 134.62,38.1 C4.C21 132.08,39.37 110.49,39.37 109.22,38.1 C3.C21 106.68,39.37 85.09,39.37 83.82,38.1 C2.C21 81.28,39.37 59.69,39.37 58.42,38.1 C1.C21 55.88,39.37 RN13.4 RN19.4
C22
  Bottom 0.254: RN4.3 RN1.3 C7.C22 208.28,36.83 186.69,36.83 185.42,35.56 C6.C22 182.88,36.83 161.29,36.83 160.02,35.56 C5.C22 157.48,36.83 135.89,36.83 134.62,35.56 C4.C22 132.08,36.83 110.49,36.83 109.22,35.56 C3.C22 106.68,36.83 85.09,36.83 83.82,35.56 C2.C22 81.28,36.83 59.69,36.83 58.42,35.56 C1.C22 55.88,36.83 RN13.3 RN19.3
C23
  Bottom 0.254: RN4.2 RN1.2 C7.C23 208.28,34.29 186.69,34.29 185.42,33.02 C6.C23 182.88,34.29 161.29,34.29 160.02,33.02 C5.C23 157.48,34.29 135.89,34.29 134.62,33.02 C4.C23 132.08,34.29 110.49,34.29 109.22,33.02 C3.C23 106.68,34.29 85.09,34.29 83.82,33.02 C2.C23 81.28,34.29 59.69,34.29 58.42,33.02 C1.C23 55.88,34.29 RN13.2 RN19.2
C24
  Bottom 0.254: RN9.9 RN10.9 212.09,31.75 210.82,30.48 C7.C24 208.28,31.75 186.69,31.75 185.42,30.48 C6.C24 182.88,31.75 161.29,31.75 160.02,30.48 C5.C24 157.48,31.75 135.89,31.75 134.62,30.48 C4.C24 132.08,31.75 110.49,31.75 109.22,30.48 C3.C24 106.68,31.75 85.09,31.75 83.82,30.48 C2.C24 81.28,31.75 59.69,31.75 58.42,30.48 C1.C24 54.61,30.48 53.34,29.21 RN16.9 RN22.9
C25
  Top 0.254: C7.C25 210.82,27.94 212.09,29.21 RN10.8 RN9.8
  Bottom 0.254: C7.C25 208.28,29.21 186.69,29.21 185.42,27.94 C6.C25 182.88,29.21 161.29,29.21 160.02,27.94 C5.C25 157.48,29.21 135.89,29.21 134.62,27.94 C4.C25 132.08,29.21 110.49,29.21 109.22,27.94 C3.C25 106.68,29.21 85.09,29.21 83.82,27.94 C2.C25 81.28,29.21 59.69,29.21 58.42,27.94 C1.C25 54.61,27.94 53.34,26.67 RN16.8 RN22.8
C26
  Top 0.254: C7.C26 210.82,25.4 212.09,26.67 RN10.7 RN9.7
  Bottom 0.254: C7.C26 208.28,26.67 186.69,26.67 185.42,25.4 C6.C26 182.88,26.67 161.29,26.67 160.02,25.4 C5.C26 157.48,26.67 135.89,26.67 134.62,25.4 C4.C26 132.08,26.67 110.49,26.67 109.22,25.4 C3.C26 106.68,26.67 85.09,26.67 83.82,25.4 C2.C26 81.28,26.67 59.69,26.67 58.42,25.4 C1.C26 54.61,25.4 53.34,24.13 RN16.7 RN22.7 8.89,24.13 7.62,25.4 JP1.1
C27
  Top 0.254: C7.C27 210.82,22.86 212.09,24.13 RN10.6 RN9.6
  Bottom 0.254: C7.C27 208.28,24.13 186.69,24.13 185.42,22.86 C6.C27 182.88,24.13 161.29,24.13 160.02,22.86 C5.C27 157.48,24.13 135.89,24.13 134.62,22.86 C4.C27 132.08,24.13 110.49,24.13 109.22,22.86 C3.C27 106.68,24.13 85.09,24.13 83.82,22.86 C2.C27 81.28,24.13 59.69,24.13 58.42,22.86 C1.C27 54.61,22.86 53.34,21.59 RN16.6 RN22.6
C28
  Top 0.254: RN9.5 RN10.5 212.09,21.59 210.82,20.32 C7.C28 208.28,21.59 186.69,21.59 185.42,20.32 C6.C28 182.88,21.59 161.29,21.59 160.02,20.32 C5.C28 157.48,21.59 135.89,21.59 134.62,20.32 C4.C28 132.08,21.59 110.49,21.59 109.22,20.32 C3.C28 106.68,21.59 85.09,21.59 83.82,20.32 C2.C28 81.28,21.59 59.69,21.59 58.42,20.32 C1.C28 54.61,20.32 53.34,19.05 RN16.5 RN22.5
C29
  Top 0.254: RN9.4 RN10.4 212.09,19.05 210.82,17.78 C7.C29 208.28,19.05 186.69,19.05 185.42,17.78 C6.C29 182.88,19.05 161.29,19.05 160.02,17.78 C5.C29 157.48,19.05 135.89,19.05 134.62,17.78 C4.C29 132.08,19.05 110.49,19.05 109.22,17.78 C3.C29 106.68,19.05 85.09,19.05 83.82,17.78 C2.C29 81.28,19.05 59.69,19.05 58.42,17.78 C1.C29 54.61,17.78 53.34,16.51 RN16.4 RN22.4
C30
  Top 0.254: RN9.3 RN10.3 212.09,16.51 210.82,15.24 C7.C30 208.28,16.51 186.69,16.51 185.42,15.24 C6.C30 182.88,16.51 161.29,16.51 160.02,15.24 C5.C30 157.48,16.51 135.89,16.51 134.62,15.24 C4.C30 132.08,16.51 110.49,16.51 109.22,15.24 C3.C30 106.68,16.51 85.09,16.51 83.82,15.24 C2.C30 81.28,16.51 59.69,16.51 58.42,15.24 C1.C30 54.61,15.24 53.34,13.97 RN16.3 RN22.3
C31
  Top 0.254: RN9.2 RN10.2 212.09,13.97 210.82,12.7 C7.C31 208.28,13.97 186.69,13.97 185.42,12.7 C6.C31 182.88,13.97 161.29,13.97 160.02,12.7 C5.C31 157.48,13.97 135.89,13.97 134.62,12.7 C4.C31 132.08,13.97 110.49,13.97 109.22,12.7 C3.C31 106.68,13.97 85.09,13.97 83.82,12.7 C2.C31 81.28,13.97 59.69,13.97 58.42,12.7 C1.C31 54.61,12.7 53.34,11.43 RN16.2 RN22.2
GND
  pour Bottom (isolate 0.305): 0,0 0,99.06 243.84,99.06 243.84,0
N$1  (via drill 2.8)
  other vias: 3.81,95.25
N$2  (via drill 2.8)
  other vias: 240.03,95.25
N$3  (via drill 2.8)
  other vias: 240.03,3.81
N$4  (via drill 2.8)
  other vias: 3.81,3.81
VCC
  pour Top (isolate 0.305): 0,7.62 0,91.44 7.62,91.44 7.62,99.06 236.22,99.06 236.22,91.44 243.84,91.44 243.84,7.62 236.22,7.62 236.22,0 7.62,0 7.62,7.62

### Text on the board
tNames: CS/A65 Backplane V1.2 / (C) S.Aguayo | GND | Board 1 | Board 2 | Board 3 | Board 4 | Board 5 | Board 6 | Board 7